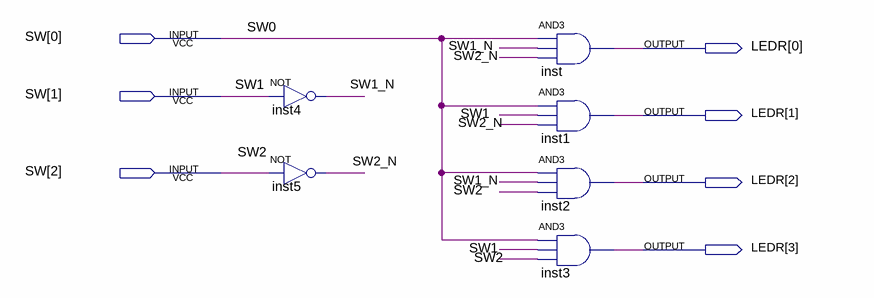
[diagram p0: schematic sheet]
// Quartus schematic demux_1_a_4.bdf as structural Verilog: 6 symbols, 7 pins
module demux_1_a_4 (
  input  [2:0] SW,
  output [3:0] LEDR
);

  wire SW1_N, SW2_N;

  not inst4 (SW1_N, SW[1]);
  not inst5 (SW2_N, SW[2]);
  and inst (LEDR[0], SW[0], SW1_N, SW2_N);
  and inst1 (LEDR[1], SW[0], SW[1], SW2_N);
  and inst2 (LEDR[2], SW[0], SW1_N, SW[2]);
  and inst3 (LEDR[3], SW[0], SW[1], SW[2]);
endmodule
